# EasyEDA schematic EasyEDA_Walrusgand_Projectfile.json
TITLE: Walrusgand Schematic; REV: 1.0; Date: 2019-06-22; Sheet: 1/1; Drawn By: Daniel Underhay; Company: Walrus
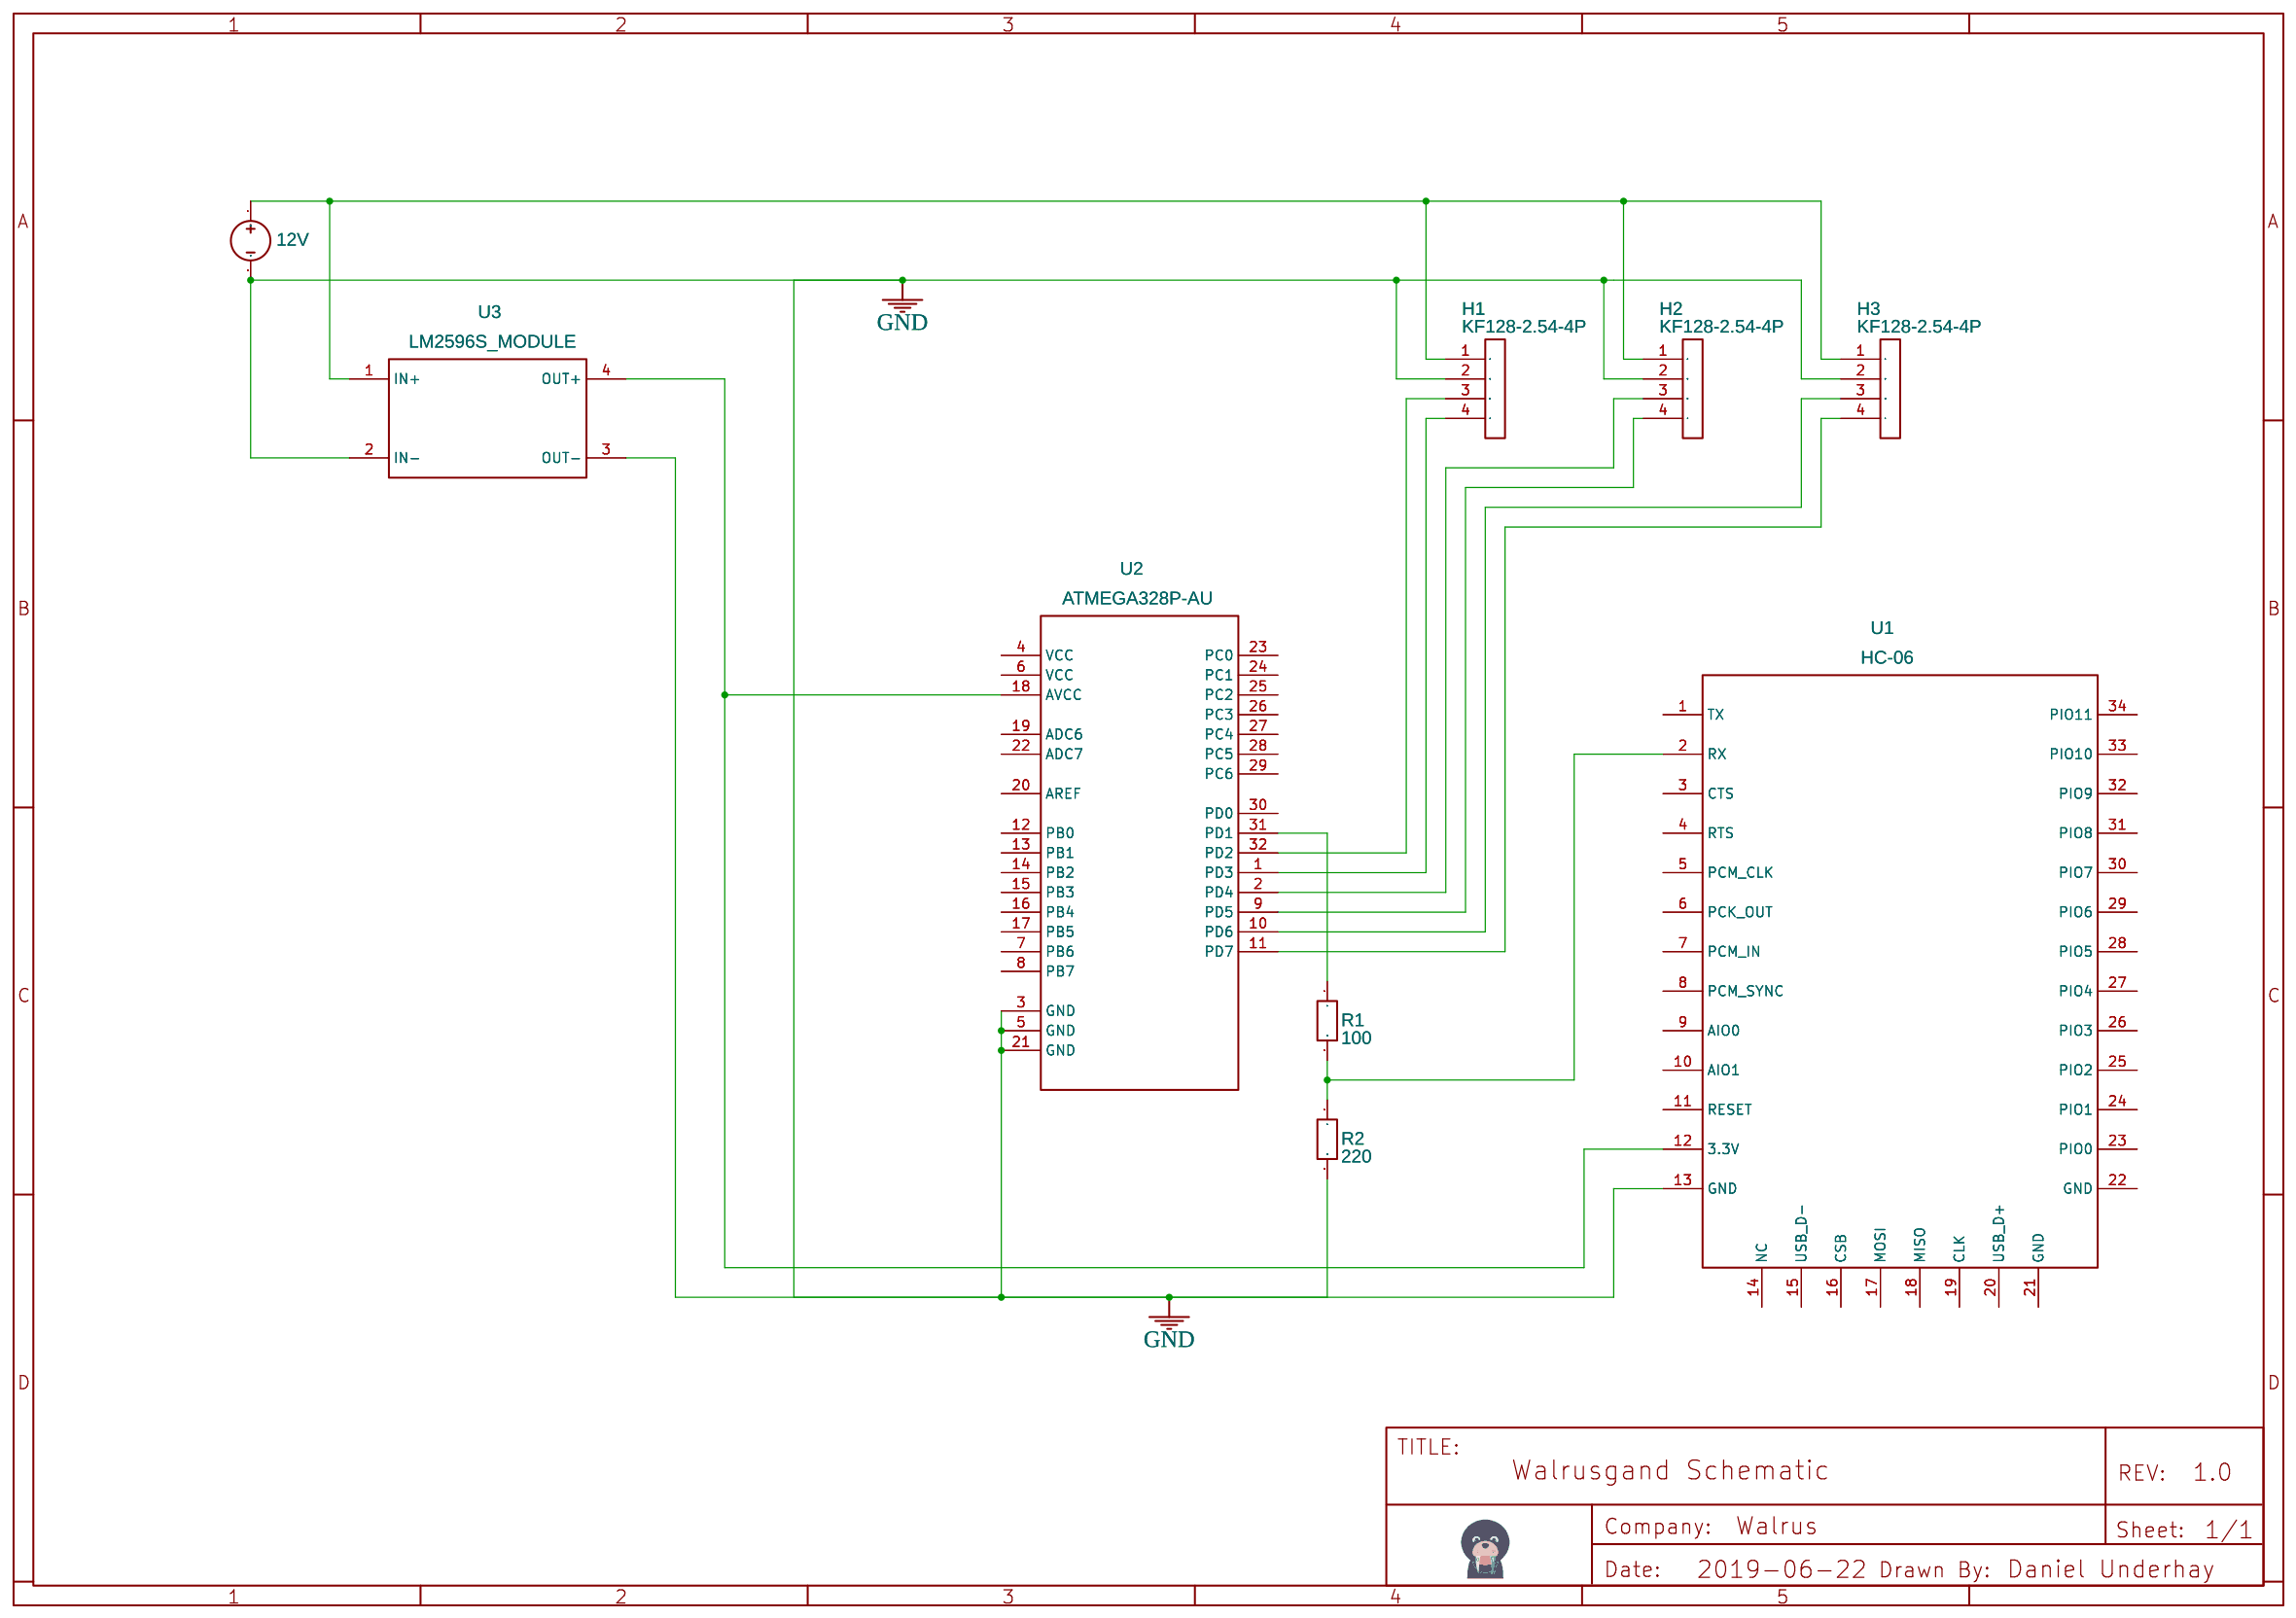
[diagram p0: schematic sheet]

## Parts
12V  SIN(5) AC 1 0  [HDR1X2]
H1  KF128-2.54-4P  [KF128-2.54-4P]
H2  KF128-2.54-4P  [KF128-2.54-4P]
H3  KF128-2.54-4P  [KF128-2.54-4P]
R1  100  [0603]
R2  220  [0603]
U1  HC-06  [HC-06 SMD]
U2  ATMEGA328P-AU  [TQFP-32_7X7X08P]
U3  LM2596S_MODULE  [LM2596S_MODULE_SMD]

## Library data of the parts
12V = Vsin: Manufacturer Part: ?; power_0: 12; power_function: SIN
H1-H3 = -: Manufacturer: Kefa; link: http://en.cnkefa.com/uploads/2016/07/071521073799.pdf; Contributor: chan48969999
R1 R2 = Res_0603(1/10W)_EU: Manufacturer Part: ?
U1 = -: Manufacturer Part: hc06; Contributor: evillee1123
U2 = -: Supplier: LCSC; Manufacturer: MICROCHIP; image: //image.lceda.cn/szlcsc/C14877.jpg; Supplier Part: C14877; LCSC Assembly: Yes; SMT Type: Extend
U3 = -: Contributor: erma4ok69; Manufacturer Part: ?

## Nets
GND: 12V.2 H1.2 H2.2 H3.2 R2.2 U1.13(GND) U2.3(GND) U2.5(GND) U2.21(GND) U3.2(IN-) U3.3(OUT-)
Net-(12V-1): 12V.1 H1.1 H2.1 H3.1 U3.1(IN+)
Net-(H1-3): H1.3 U2.32(PD2)
Net-(H1-4): H1.4 U2.1(PD3)
Net-(H2-3): H2.3 U2.2(PD4)
Net-(H2-4): H2.4 U2.9(PD5)
Net-(H3-3): H3.3 U2.10(PD6)
Net-(H3-4): H3.4 U2.11(PD7)
Net-(R1-1): R1.1 U2.31(PD1)
Net-(R1-2): R1.2 R2.1 U1.2(RX)
Net-(U1-12): U1.12(3.3V) U2.18(AVCC) U3.4(OUT+)

Not connected (* = marked no-connect by the designer): U1 1(TX) 3(CTS) 4(RTS) 5(PCM CLK) 6(PCK OUT) 7(PCM IN) 8(PCM SYNC) 9(AIO0) 10(AIO1) 11(RESET) 14(NC) 15(USB D-) 16(CSB) 17(MOSI) 18(MISO) 19(CLK) 20(USB D+) 21(GND) 22(GND) 23(PIO0) 24(PIO1) 25(PIO2) 26(PIO3) 27(PIO4) 28(PIO5) 29(PIO6) 30(PIO7) 31(PIO8) 32(PIO9) 33(PIO10) 34(PIO11); U2 4(VCC) 6(VCC) 7(PB6) 8(PB7) 12(PB0) 13(PB1) 14(PB2) 15(PB3) 16(PB4) 17(PB5) 19(ADC6) 20(AREF) 22(ADC7) 23(PC0) 24(PC1) 25(PC2) 26(PC3) 27(PC4) 28(PC5) 29(PC6) 30(PD0)
